# EAGLE design Task11 (EAGLE 7.1.0)
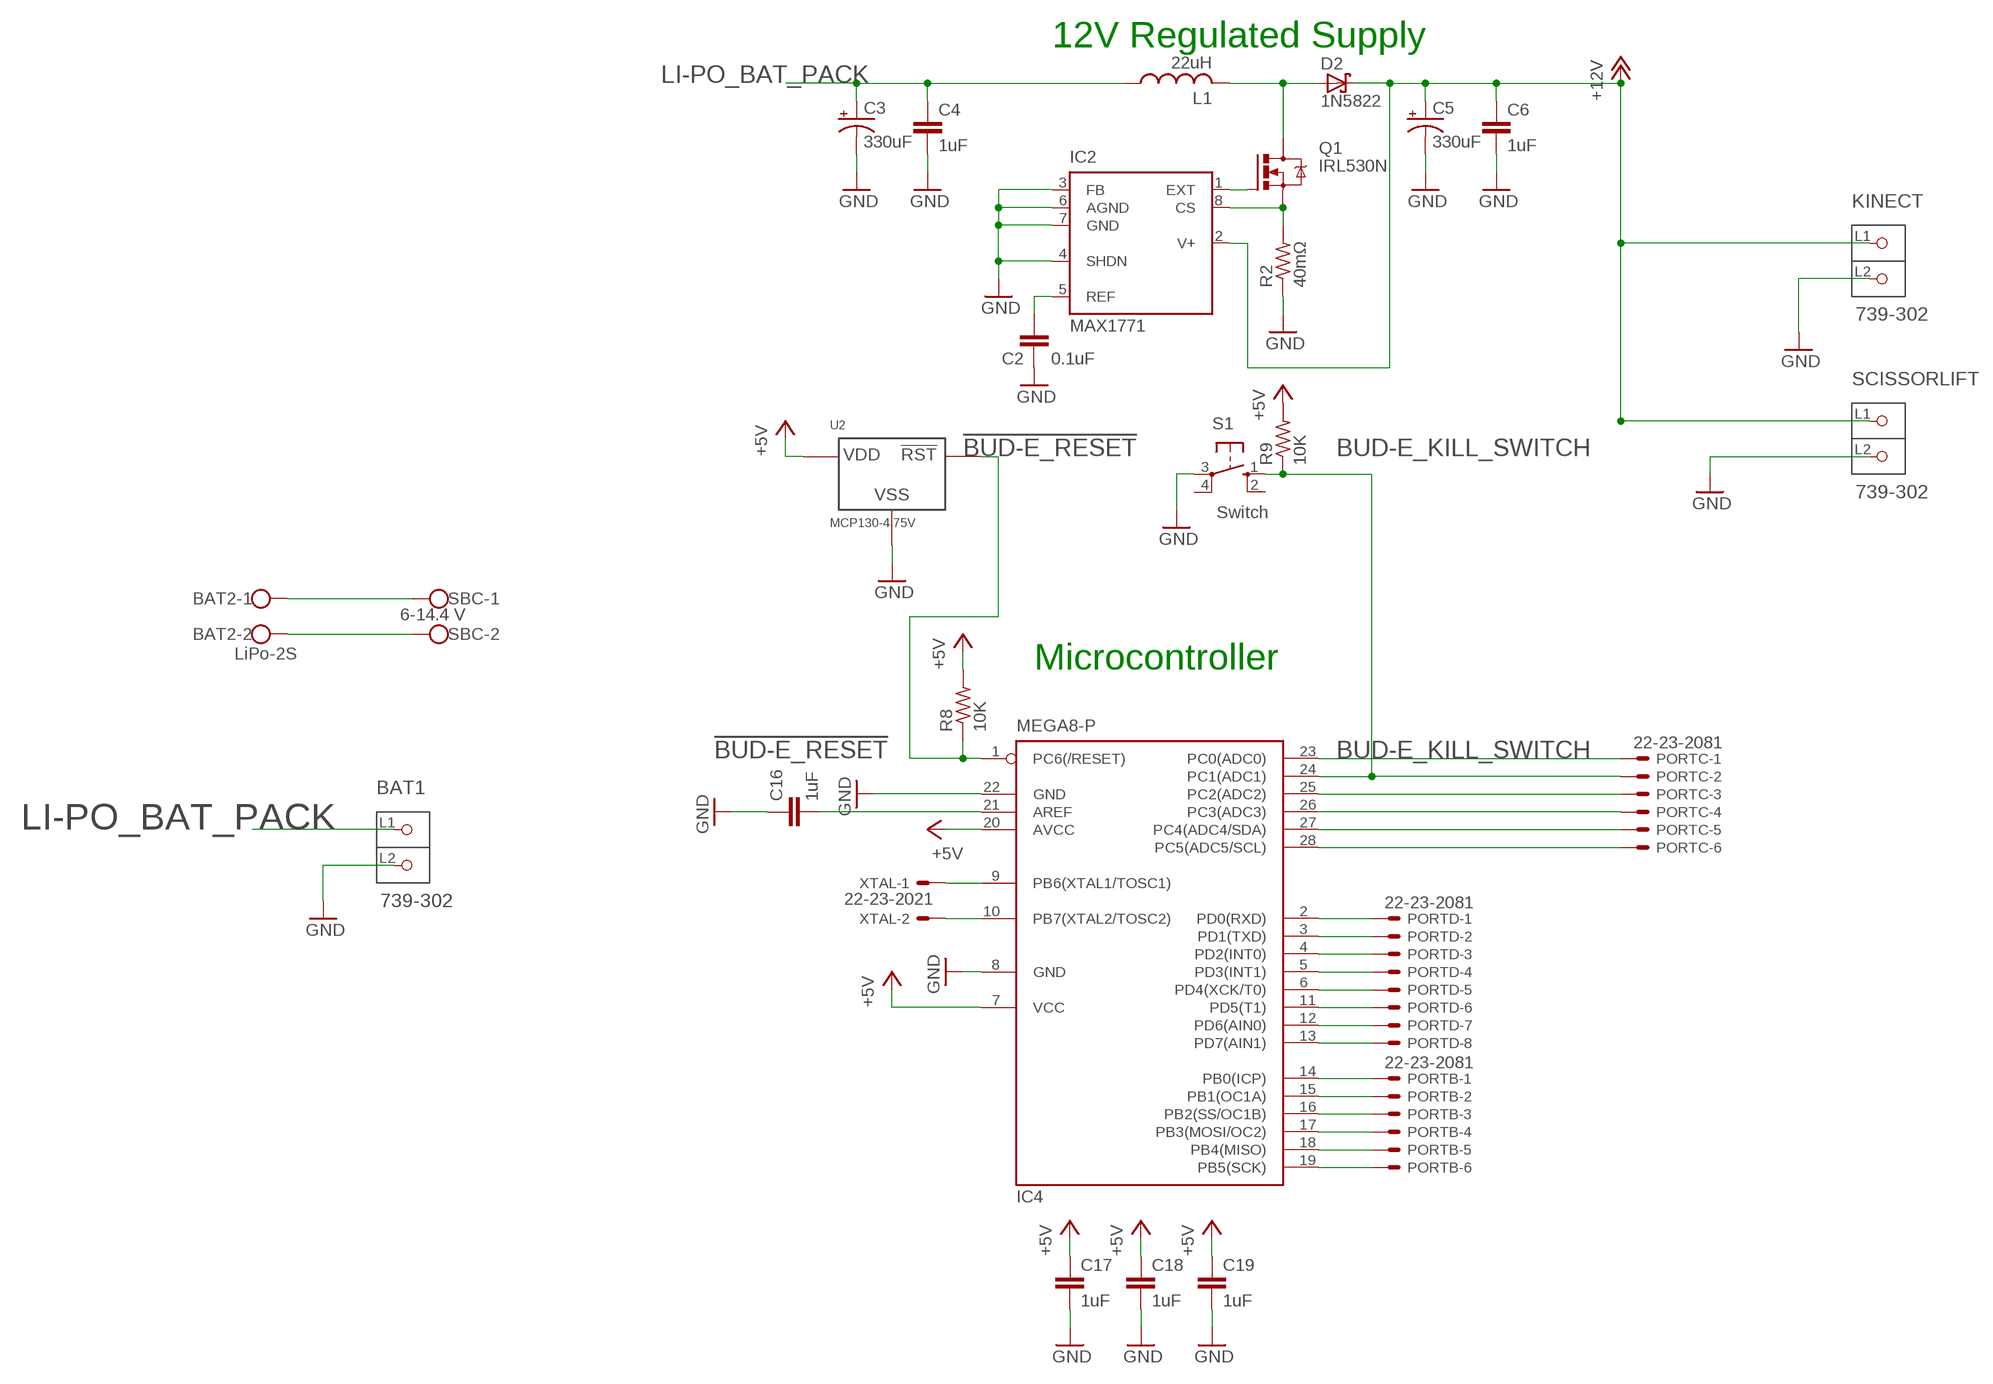
[diagram p0: schematic, sheet 1]

## Parts
BAT1  739-302  [P-739-302]
BAT2  LiPo-2S  W237-113  [W237-113]
C2  0.1uF  C-EU025-025X050  [C025-025X050]
C3  330uF  CPOL-USE2.5-6  [E2,5-6]
C4  1uF  C-EU025-025X050  [C025-025X050]
C5  330uF  CPOL-USE2.5-6  [E2,5-6]
C6  1uF  C-EU025-025X050  [C025-025X050]
C16  1uF  C-EU025-025X050  [C025-025X050]
C17  1uF  C-EU025-025X050  [C025-025X050]
C18  1uF  C-EU025-025X050  [C025-025X050]
C19  1uF  C-EU025-025X050  [C025-025X050]
D2  1N5822  1N5908  [C4111-15]
IC2  MAX1771  [DIL08]
IC4  MEGA8-P  [DIL28-3]
KINECT  739-302  [P-739-302]
L1  22uH  L-US0207/15  [0207/15]
PORTB  22-23-2081  22-23-2061  [22-23-2061]
PORTC  22-23-2081  22-23-2061  [22-23-2061]
PORTD  22-23-2081  [22-23-2081]
Q1  IRL530N  IRF530  [TO220BV]
R2  40mΩ  R-US_0207/12  [0207/12]
R8  10K  R-US_0204/7  [0204/7]
R9  10K  R-US_0204/7  [0204/7]
S1  Switch  10-XX  [B3F-10XX]
SBC  6-14.4 V  W237-113  [W237-113]
SCISSORLIFT  739-302  [P-739-302]
U2  MCP130-4.75V  MCP130'  [TO92]
XTAL  22-23-2021  [22-23-2021]

## Nets
!BUD-E_RESET: IC4.1(PC6(/RESET)) R8.1 U2.1(!RST)
+5V: C17.1 C18.1 C19.1 IC4.7(VCC) IC4.20(AVCC) R8.2 R9.2 U2.2(VDD)
+12V: C5.+ C6.1 D2.C IC2.2(V+) KINECT.L1(P1) SCISSORLIFT.L1(P1)
BUD-E_KILL_SWITCH: IC4.24(PC1(ADC1)) PORTC.2 R9.1 S1.1(S)
GND: BAT1.L2(P2) C2.1 C3.- C4.2 C5.- C6.2 C16.1 C17.2 C18.2 C19.2 IC2.3(FB) IC2.4(SHDN) IC2.6(AGND) IC2.7(GND) IC4.8(GND) IC4.22(GND) KINECT.L2(P2) R2.1 S1.3(P) SCISSORLIFT.L2(P2) U2.3(VSS)
LI-PO_BAT_PACK: BAT1.L1(P1) C3.+ C4.1 L1.1
N$1: IC2.1(EXT) Q1.G
N$2: C2.2 IC2.5(REF)
N$3: IC2.8(CS) Q1.S R2.2
N$4: IC4.23(PC0(ADC0)) PORTC.1
N$5: IC4.25(PC2(ADC2)) PORTC.3
N$6: IC4.26(PC3(ADC3)) PORTC.4
N$7: D2.A L1.2 Q1.D
N$8: IC4.27(PC4(ADC4/SDA)) PORTC.5
N$9: IC4.28(PC5(ADC5/SCL)) PORTC.6
N$10: IC4.2(PD0(RXD)) PORTD.1
N$11: IC4.9(PB6(XTAL1/TOSC1)) XTAL.1
N$12: IC4.3(PD1(TXD)) PORTD.2
N$13: IC4.4(PD2(INT0)) PORTD.3
N$14: IC4.5(PD3(INT1)) PORTD.4
N$15: IC4.6(PD4(XCK/T0)) PORTD.5
N$16: IC4.11(PD5(T1)) PORTD.6
N$17: IC4.12(PD6(AIN0)) PORTD.7
N$18: IC4.13(PD7(AIN1)) PORTD.8
N$19: IC4.14(PB0(ICP)) PORTB.1
N$20: IC4.15(PB1(OC1A)) PORTB.2
N$21: IC4.16(PB2(SS/OC1B)) PORTB.3
N$22: IC4.17(PB3(MOSI/OC2)) PORTB.4
N$23: IC4.18(PB4(MISO)) PORTB.5
N$24: IC4.19(PB5(SCK)) PORTB.6
N$25: BAT2.1 SBC.1
N$26: BAT2.2 SBC.2
N$27: C16.2 IC4.21(AREF)
N$28: IC4.10(PB7(XTAL2/TOSC2)) XTAL.2
Unconnected: S1.2(S1) S1.4(P1)

## Notes on the sheet
- 12V Regulated Supply
- Microcontroller

## Library data of the parts
BAT1 KINECT SCISSORLIFT = connector_wago:739-302: Connector for 12V and higher amp rating.
BAT2 SBC = connector_wago-W237-113:W237-113: WAGO SCREW CLAMP; OC_FARNELL: unknown; OC_NEWARK: unknown
C2 C4 C6 C16-C19 = rcl:C-EU: CAPACITOR, European symbol
C3 C5 = rcl:CPOL-US: POLARIZED CAPACITOR, American symbol
D2 = diode:1N5908: DIODE schottky
IC2 = ivan:MAX1771: 500mA Low-Dropout Linear Regulator in µMAX Source: http://www.maxim-ic.com .. MAX1792-1.pdf
IC4 = atmel:MEGA8-P: MICROCONTROLLER 8 Kbytes FLASH, 1 kbytes SRAM, 512 bytes EEPROM, USART, 4-channel 10 bit ADC, 2-channel 8 bit ADC Pin compatible with Atmega48, ATMega88, ATMega168 Source: avr.lbr; OC_FARNELL: unknown; OC_NEWARK: unknown
L1 = rcl:L-US: INDUCTOR, American symbol
PORTB PORTC = con-molex:22-23-2061: .100" (2.54mm) Center Header - 6 Pin; MF: MOLEX; MPN: 22-23-2061; OC_FARNELL: 1462922; OC_NEWARK: 27C1933
PORTD = con-molex:22-23-2081: .100" (2.54mm) Center Header - 8 Pin; MF: MOLEX; MPN: 22-23-2081; OC_FARNELL: 1756826; OC_NEWARK: 01C7592
Q1 = transistor-power:IRF530: HEXFET Power MOSFET
R2 R8 R9 = rcl:R-US_: RESISTOR, American symbol
S1 = switch-omron:10-XX: OMRON SWITCH; MPN: B3F-1000; OC_FARNELL: 176432; OC_NEWARK: 36M3542
U2 = ivan:MCP130
XTAL = con-molex:22-23-2021: .100" (2.54mm) Center Header - 2 Pin; MF: MOLEX; MPN: 22-23-2021; OC_FARNELL: 1462926; OC_NEWARK: 25C3832

## Board
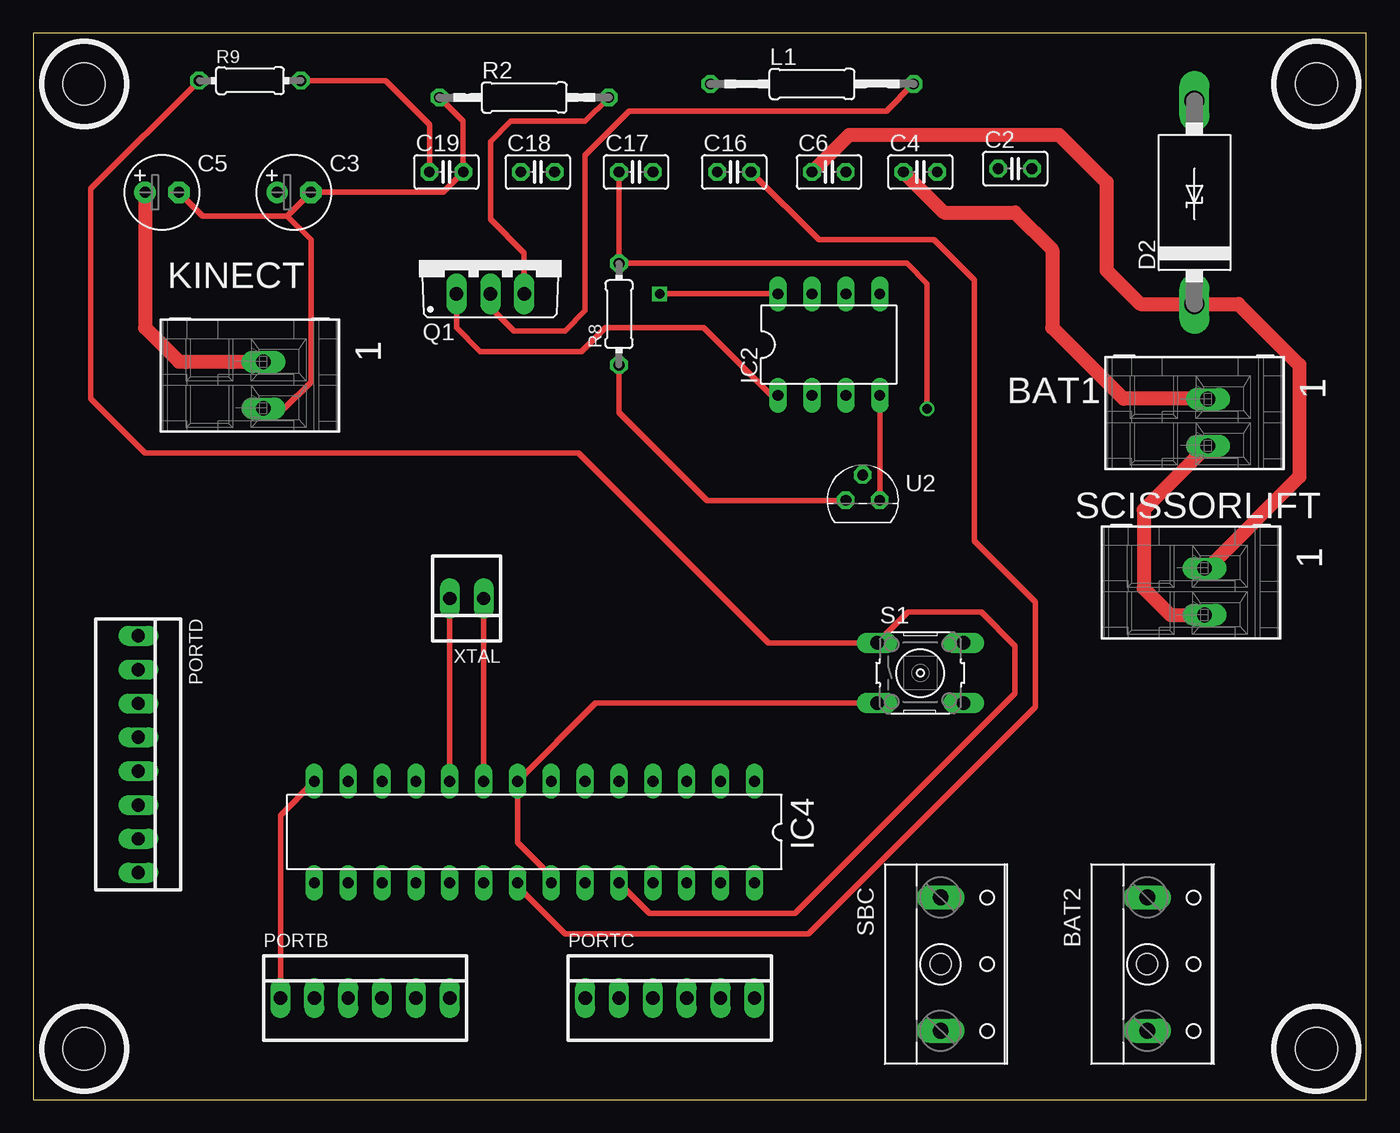
[diagram p1: board, top side]
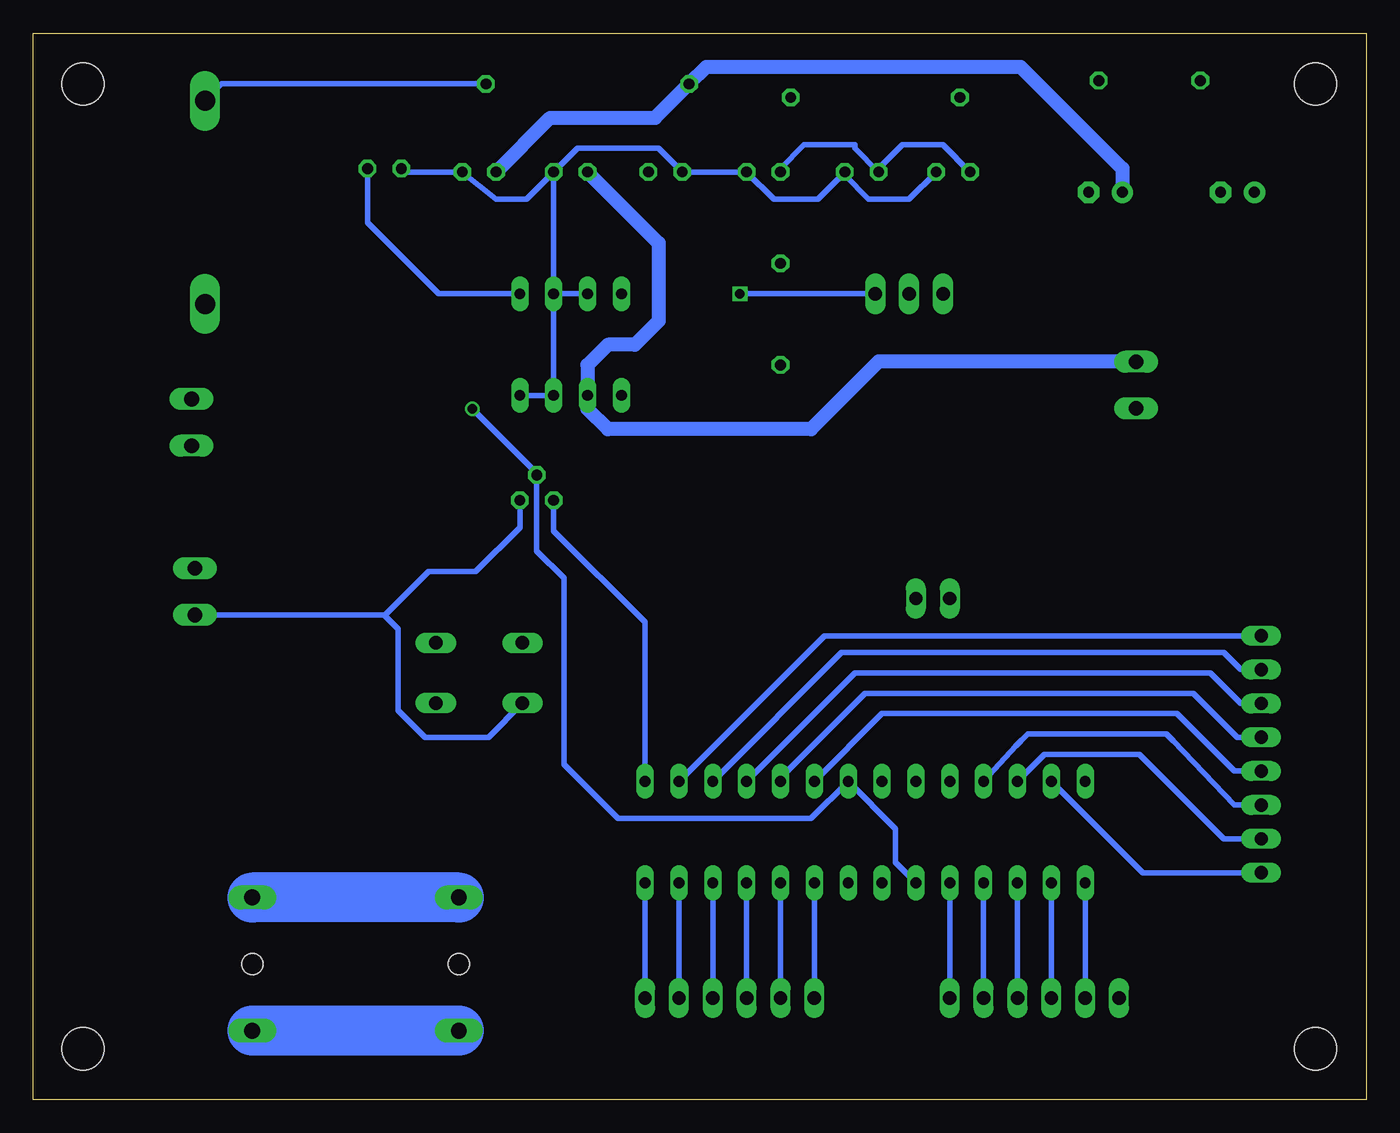
[diagram p2: board, bottom side, seen from below]

Size 100 x 80 mm. Coordinates in mm from the lower left corner, seen from the top.
Outline: 0,0 100,0 100,80 0,80 0,0
Copper layers (1*16): Top 0.035mm / dielectric 1.5mm / Bottom 0.035mm
Design rules "default": minimum track width 10mil, minimum drill 24mil, track to track 8mil, track to pad 8mil, pad to pad 8mil, via to via 8mil, smd to smd 8mil, copper to edge 40mil, drill to drill 8mil, minimum pad ring 10mil, minimum via ring 8mil, stop-mask expansion 4mil, vias tented up to drill 0mil, thermal gap 10mil
Holes 3.17 mm at 96.27,3.81 96.27,76.2 3.81,76.2 3.81,3.81
Holes 1.59 mm at 68.07,10.16 83.57,10.16

### Footprints (pad centres in the part's own frame; a part is rotated, then mirrored left to right if it is on the bottom)
P-739-302 = drill 1.1 long: L1 1,1; L2 1,-2.5
W237-113 = drill 1.194 long: 1 -5,-1.27; 2 5,-1.27
C025-025X050 = drill 0.813 octagon: 1 -1.27,0; 2 1.27,0
E2,5-6 = drill 0.813 pad 1.6: + -1.27,0 | drill 0.813 pad 1.6 octagon: - 1.27,0
C4111-15 = drill 1.499 long: A 7.62,0; C -7.62,0
DIL08 = drill 0.813 long: 1 -3.81,-3.81; 2 -1.27,-3.81; 3 1.27,-3.81; 4 3.81,-3.81; 5 3.81,3.81; 6 1.27,3.81; 7 -1.27,3.81; 8 -3.81,3.81
DIL28-3 = drill 0.813 long: 1 -16.51,-3.81; 2 -13.97,-3.81; 3 -11.43,-3.81; 4 -8.89,-3.81; 5 -6.35,-3.81; 6 -3.81,-3.81; 7 -1.27,-3.81; 8 1.27,-3.81; 9 3.81,-3.81; 10 6.35,-3.81; 11 8.89,-3.81; 12 11.43,-3.81; 13 13.97,-3.81; 14 16.51,-3.81; 15 16.51,3.81; 16 13.97,3.81; 17 11.43,3.81; 18 8.89,3.81; 19 6.35,3.81; 20 3.81,3.81; 21 1.27,3.81; 22 -1.27,3.81; 23 -3.81,3.81; 24 -6.35,3.81; 25 -8.89,3.81; 26 -11.43,3.81; 27 -13.97,3.81; 28 -16.51,3.81
0207/15 = drill 0.813 octagon: 1 -7.62,0; 2 7.62,0
22-23-2061 = drill 1 long: 1 -6.35,0; 2 -3.81,0; 3 -1.27,0; 4 1.27,0; 5 3.81,0; 6 6.35,0
22-23-2081 = drill 1 long: 1 -8.89,0; 2 -6.35,0; 3 -3.81,0; 4 -1.27,0; 5 1.27,0; 6 3.81,0; 7 6.35,0; 8 8.89,0
TO220BV = drill 1.016 long: D 0,-2.54; G -2.54,-2.54; S 2.54,-2.54
0207/12 = drill 0.813 octagon: 1 -6.35,0; 2 6.35,0
0204/7 = drill 0.813 octagon: 1 -3.81,0; 2 3.81,0
B3F-10XX = drill 1.016 long: 1 -3.251,2.261; 2 3.251,2.261; 3 -3.251,-2.261; 4 3.251,-2.261
TO92 = drill 0.813 octagon: 1 -1.27,0; 2 0,1.905; 3 1.27,0
22-23-2021 = drill 1 long: 1 -1.27,0; 2 1.27,0

### Placement (x,y rotation side)
BAT1  87.12,51.56 0 top
BAT2  84.84,10.16 270 top
C2  73.66,69.85 0 top
C3  19.56,68.07 0 top
C4  66.55,69.6 0 top
C5  9.65,68.07 0 top
C6  59.69,69.6 0 top
C16  52.58,69.6 0 top
C17  45.21,69.6 0 top
C18  37.85,69.6 0 top
C19  30.99,69.6 0 top
D2  87.12,67.31 90 top
IC2  59.69,56.64 0 top
IC4  37.59,20.07 180 top
KINECT  16.26,54.36 0 top
L1  58.42,76.2 0 top
PORTB  24.89,7.62 0 top
PORTC  47.75,7.62 0 top
PORTD  7.87,25.91 270 top
Q1  34.29,62.99 0 top
R2  36.83,75.18 0 top
R8  43.94,58.93 90 top
R9  16.26,76.45 0 top
S1  66.55,32 0 top
SBC  69.34,10.16 270 top
SCISSORLIFT  86.87,38.86 0 top
U2  62.23,44.96 0 top
XTAL  32.51,37.59 180 top

### Tracks (layer width: path | path; a pad name or v marks a point on that pad's centre or on a via)
!BUD-E_RESET
  Top 0.406: R8.1 43.94,51.56 50.55,44.96 U2.1
  Bottom 0.406: U2.1 60.96,42.67 54.1,35.81 IC4.1
+5V  (via drill 0.7)
  Top 0.406: R9.2 26.42,76.45 29.72,73.15 C19.1 | C17.1 R8.2 65.53,62.74 67.06,61.21 v67.06,51.82
  Bottom 0.406: C19.1 31.75,71.63 34.8,71.63 36.58,69.85 C18.1 38.35,71.37 38.35,71.63 42.16,71.63 43.94,69.85 C17.1 | IC4.20 35.31,17.78 35.31,20.32 IC4.7 41.66,21.08 56.13,21.08 60.2,25.15 60.2,39.12 62.23,41.15 U2.2 62.23,46.99 v67.06,51.82
+12V
  Top 0.406: 88.12,39.86 SCISSORLIFT.L1
  Top 1.067: C6.1 61.21,72.39 76.96,72.39 80.52,68.83 80.52,62.23 83.06,59.69 D2.C 90.42,59.69 95,55.12 95,46.74 88.12,39.86 | KINECT.L1 10.94,55.36 8.38,57.91 C5.+
  Bottom 0.406: 58.17,52.83 IC2.2 | KINECT.L1 17.27,55.37
  Bottom 1.067: 17.27,55.37 36.58,55.37 41.66,50.29 56.9,50.29 58.42,51.82 IC2.2 58.42,55.12 56.9,56.64 54.86,56.64 53.09,58.42 53.09,64.26 C6.1
BUD-E_KILL_SWITCH
  Top 0.406: R9.1 4.32,68.33 4.32,52.58 8.38,48.51 40.89,48.51 55.14,34.27 S1.1 65.61,36.58 71.12,36.58 73.66,34.04 73.66,30.48 57.15,13.97 46.23,13.97 IC4.24
  Bottom 0.406: PORTC.2 IC4.24
GND
  Top 0.406: IC2.4 U2.3 | KINECT.L2 18.84,51.86 20.83,53.85 20.83,64.52 19.05,66.29 | S1.3 42.19,29.74 IC4.8 36.32,19.3 38.86,16.76 IC4.22 | C5.- 12.7,66.29 19.05,66.29 | 19.05,66.29 C3.- 30.73,68.07 C19.2 32.26,73.41 R2.1
  Top 1.067: BAT1.L2 83.31,44.25 83.31,38.35 85.3,36.36 SCISSORLIFT.L2
  Bottom 0.406: C19.2 34.29,67.56 37.34,67.56 39.12,69.34 C18.2 41.15,67.56 44.45,67.56 C17.2 C16.1 53.09,71.37 59.18,71.37 C6.2 | C2.1 72.14,69.6 C4.2 65.28,67.56 62.99,67.56 C6.2 | C6.2 IC2.6 | IC2.6 IC2.7 | IC2.4 IC2.3 IC2.6 | U2.3 63.5,42.93 66.8,39.62 70.36,39.62 73.62,36.36 | S1.3 65.86,27.18 70.61,27.18 72.64,29.21 72.64,35.31 73.62,36.28 73.62,36.36 | 73.62,36.36 SCISSORLIFT.L2
LI-PO_BAT_PACK
  Top 0.406: BAT1.L1 88.11,52.58
  Top 1.067: C4.1 68.33,66.55 73.66,66.55 76.45,63.75 76.45,57.91 81.79,52.58 88.11,52.58
  Bottom 1.067: C4.1 61.21,73.66 53.34,73.66 L1.1 49.53,77.47 25.91,77.47 18.29,69.85 C3.+
N$1
  Top 0.406: Q1.G 31.75,57.91 33.53,56.13 41.15,56.13 42.93,57.91 50.29,57.91 55.37,52.83 IC2.1
N$2
  Bottom 0.406: C2.2 74.93,65.79 69.6,60.45 IC2.5
N$3  (via drill 0.7)
  Top 0.406: Q1.S 36.83,63.5 34.29,66.04 34.29,71.88 35.81,73.41 41.4,73.41 R2.2 | v46.99,60.45 IC2.8
  Bottom 0.406: Q1.S v46.99,60.45
N$4
  Bottom 0.406: IC4.23 PORTC.1
N$5
  Bottom 0.406: IC4.25 PORTC.3
N$6
  Bottom 0.406: PORTC.4 IC4.26
N$7
  Top 0.406: Q1.D 34.29,59.44 36.07,57.66 39.88,57.66 41.4,59.18 41.4,70.87 44.7,74.17 64.01,74.17 L1.2
  Bottom 0.406: D2.A 85.85,76.2 L1.2
N$8
  Bottom 0.406: IC4.27 PORTC.5
N$9
  Bottom 0.406: PORTC.6 IC4.28
N$10
  Bottom 0.406: PORTD.1 40.64,34.8 IC4.2
N$11
  Top 0.406: IC4.9 XTAL.1
N$12
  Bottom 0.406: PORTD.2 9.4,32.26 10.67,33.53 39.37,33.53 IC4.3
N$13
  Bottom 0.406: PORTD.3 9.4,29.72 11.68,32 38.35,32 IC4.4
N$14
  Bottom 0.406: IC4.5 43.94,24.13 37.59,30.48 12.95,30.48 9.65,27.18 PORTD.4
N$15
  Bottom 0.406: PORTD.5 9.91,24.64 14.22,28.96 36.32,28.96 IC4.6
N$16
  Bottom 0.406: PORTD.6 9.91,22.1 14.48,26.92 14.99,27.43 25.4,27.43 26.27,26.57 26.27,26.53 | 25.91,26.92 26.27,26.53 | 26.27,26.53 IC4.11
N$17
  Bottom 0.406: PORTD.7 10.67,19.56 17.02,25.91 24.13,25.91 IC4.12
N$18
  Bottom 0.406: PORTD.8 16.76,17.02 IC4.13
N$19
  Top 0.406: IC4.14 18.54,21.34 PORTB.1
N$20
  Bottom 0.406: PORTB.2 IC4.15
N$21
  Bottom 0.406: PORTB.3 IC4.16
N$22
  Bottom 0.406: PORTB.4 IC4.17
N$23
  Bottom 0.406: PORTB.5 IC4.18
N$24
  Bottom 0.406: PORTB.6 IC4.19
N$25
  Bottom 3.759: SBC.1 BAT2.1
N$26
  Bottom 3.759: SBC.2 BAT2.2
N$27
  Top 0.406: C16.2 58.93,64.52 67.56,64.52 70.61,61.47 70.61,41.91 75.18,37.34 75.18,29.46 58.17,12.45 39.88,12.45 36.32,16 IC4.21
N$28
  Top 0.406: XTAL.2 IC4.10